# EAGLE design femto (EAGLE 6.4)
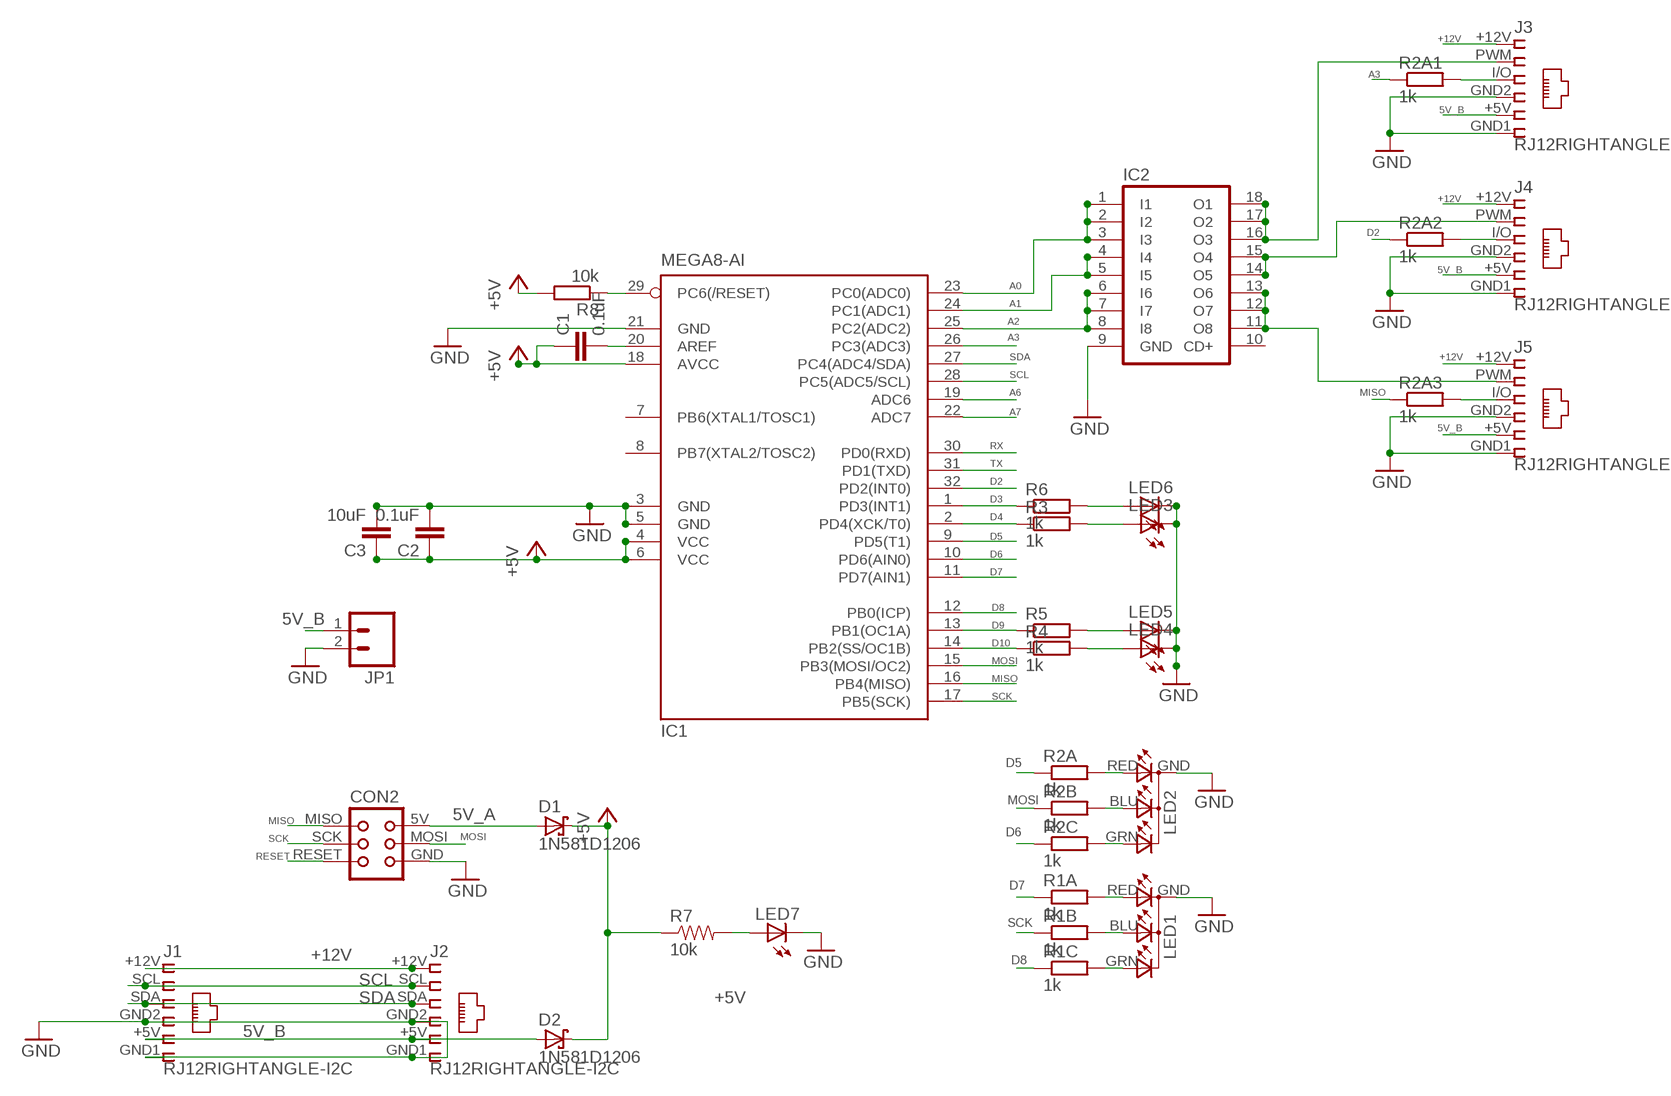
[diagram p0: schematic, sheet 1]

## Parts
C1  0.1uF  C-EUC1206  [C1206]
C2  0.1uF  C-EUC1206  [C1206]
C3  10uF  C-EUC1206  [C1206]
CON2  TINYISPTAG  [TC2030-MCP]
D1  1N581D1206  [LED-1206]
D2  1N581D1206  [LED-1206]
IC1  MEGA8-AI  [TQFP32-08]
IC2  ULN2803A  [SO18W]
J1  RJ12RIGHTANGLE-I2C  [RJ12-RIGHTANGLE-I2C]
J2  RJ12RIGHTANGLE-I2C  [RJ12-RIGHTANGLE-I2C]
J3  RJ12RIGHTANGLE  [RJ12-RIGHTANGLE]
J4  RJ12RIGHTANGLE  [RJ12-RIGHTANGLE]
J5  RJ12RIGHTANGLE  [RJ12-RIGHTANGLE]
JP1  M023.5MM  [SCREWTERMINAL-3.5MM-2]
LED1  RGB-COMMON-CATHODE  [LED-TRICOLOR-THROUGHHOLE]
LED2  RGB-COMMON-CATHODE  [LED-TRICOLOR-THROUGHHOLE]
LED3  LED3MM  [LED3MM]
LED4  LED3MM  [LED3MM]
LED5  LED3MM  [LED3MM]
LED6  LED3MM  [LED3MM]
LED7  LEDCHIP-LED0603  [CHIP-LED0603]
R1A  1k  R-EU_M1206  [M1206]
R1B  1k  R-EU_M1206  [M1206]
R1C  1k  R-EU_M1206  [M1206]
R2A  1k  R-EU_M1206  [M1206]
R2A1  1k  R-EU_M1206  [M1206]
R2A2  1k  R-EU_M1206  [M1206]
R2A3  1k  R-EU_M1206  [M1206]
R2B  1k  R-EU_M1206  [M1206]
R2C  1k  R-EU_M1206  [M1206]
R3  1k  R-EU_M1206  [M1206]
R4  1k  R-EU_M1206  [M1206]
R5  1k  R-EU_M1206  [M1206]
R6  1k  R-EU_M1206  [M1206]
R7  10k  RESISTOR0603-RES  [0603-RES]
R8  10k  R-EU_M1206  [M1206]

## Nets
5V_A: CON2.5V(VCC) D1.A
5V_B [power]: D2.A J1.+5V J2.+5V J3.+5V J4.+5V J5.+5V JP1.1
+5V [power]: C1.1 C2.1 C3.1 D1.C D2.C IC1.4(VCC) IC1.6(VCC) IC1.18(AVCC) R7.1 R8.2
+12V: J1.+12V J2.+12V J3.+12V J4.+12V J5.+12V
A0: IC1.23(PC0(ADC0)) IC2.1(I1) IC2.2(I2) IC2.3(I3)
A1: IC1.24(PC1(ADC1)) IC2.4(I4) IC2.5(I5)
A2: IC1.25(PC2(ADC2)) IC2.6(I6) IC2.7(I7) IC2.8(I8)
A3: IC1.26(PC3(ADC3)) R2A1.1
A6: IC1.19(ADC6)
A7: IC1.22(ADC7)
D2: IC1.32(PD2(INT0)) R2A2.1
D3: IC1.1(PD3(INT1)) R6.1
D4: IC1.2(PD4(XCK/T0)) R3.1
D5: IC1.9(PD5(T1)) R2A.1
D6: IC1.10(PD6(AIN0)) R2C.1
D7: IC1.11(PD7(AIN1)) R1A.1
D8: IC1.12(PB0(ICP)) R1C.1
D9: IC1.13(PB1(OC1A)) R5.1
D10: IC1.14(PB2(SS/OC1B)) R4.1
GND [power]: C2.2 C3.2 CON2.GND IC1.3(GND) IC1.5(GND) IC1.21(GND) IC2.9(GND) J1.GND1 J1.GND2 J2.GND1 J2.GND2 J3.GND1 J3.GND2 J4.GND1 J4.GND2 J5.GND1 J5.GND2 JP1.2 LED1.GND(A2) LED2.GND(A2) LED3.K(C) LED4.K(C) LED5.K(C) LED6.K(C) LED7.C
MISO: CON2.MISO IC1.16(PB4(MISO)) R2A3.1
MOSI: CON2.MOSI IC1.15(PB3(MOSI/OC2)) R2B.1
N$1: LED2.RED(CRED) R2A.2
N$2: J3.I/O R2A1.2
N$3: IC2.16(O3) IC2.17(O2) IC2.18(O1) J3.PWM
N$4: C1.2 IC1.20(AREF)
N$5: IC2.14(O5) IC2.15(O4) J4.PWM
N$6: IC2.11(O8) IC2.12(O7) IC2.13(O6) J5.PWM
N$7: LED2.BLU(CBLUE) R2B.2
N$8: LED2.GRN(CGREEN) R2C.2
N$9: J4.I/O R2A2.2
N$10: J5.I/O R2A3.2
N$15: LED7.A R7.2
N$16: LED3.A R3.2
N$20: LED1.RED(CRED) R1A.2
N$21: LED1.BLU(CBLUE) R1B.2
N$22: LED1.GRN(CGREEN) R1C.2
N$23: LED6.A R6.2
N$40: LED5.A R5.2
N$41: LED4.A R4.2
RESET: CON2.RESET IC1.29(PC6(/RESET)) R8.1
RX: IC1.30(PD0(RXD))
SCK: CON2.SCK IC1.17(PB5(SCK)) R1B.1
SCL [i2c]: IC1.28(PC5(ADC5/SCL)) J1.SCL J2.SCL
SDA [i2c]: IC1.27(PC4(ADC4/SDA)) J1.SDA J2.SDA
TX: IC1.31(PD1(TXD))
Unconnected: IC1.7(PB6(XTAL1/TOSC1)) IC1.8(PB7(XTAL2/TOSC2)) IC2.10(CD+)

## Library data of the parts
C1-C3 = resistor:C-EU: CAPACITOR, European symbol
CON2 = lpatiny:TINYISP: CONNECTOR
D1 D2 = lpatiny:1N581*: 1.0A SCHOTTKY BARRIER RECTIFIER Source: http://www.diodes.com/datasheets/ds23001.pdf
IC1 = atmel:MEGA8: MICROCONTROLLER 8 Kbytes FLASH, 1 kbytes SRAM, 512 bytes EEPROM, USART, 6-channel 10 bit ADC, 2-channel 8 bit ADC Pin compatible with Atmega48, ATMega88, ATMega168 Source: avr.lbr; MPN: ATMEGA8-16AU; OC_FARNELL: 9171371; OC_NEWARK: 73M8863
IC2 = lpatiny:ULN2803A: DRIVER ARRAY
J1-J5 = lpatiny:RJ12: CORCOM Modular RJ Jacks No Shield Source: www.tycoelectronics.com .. ENG_DS_1654001_1099_RJ_L_0507.pdf
JP1 = SparkFun:M02: Header 2 Standard 2-pin 0.1" header. Use with straight break away headers (SKU : PRT-00116), right angle break away headers (PRT-00553), swiss pins (PRT-00743), machine pins (PRT-00117), and female headers (PRT-00115). Molex polarized connector foot print use with SKU : PRT-08233 with associated crimp pins and housings.
LED1 LED2 = lpatiny:RGB-COMMON-CATHODE
LED3-LED6 = lpatiny:LED3MM
LED7 = adafruit:LED: LED OSRAM: - CHIPLED LG R971, LG N971, LY N971, LG Q971, LY Q971, LO R971, LY R971 LH N974, LH R974 LS Q976, LO Q976, LY Q976 LO Q996 - Hyper CHIPLED LW Q18S LB Q993, LB Q99A, LB R99A - SideLED LS A670, LO A670, LY A670, LG A670, LP A670 LB A673, LV A673, LT A673, LW A673 LH A674 LY A675 LS A676, LA A676, LO A676, LY A676, LW A676 LS A679, LY A679, LG A679 - Hyper Micro SIDELED® LS Y876, LA Y876, LO Y876, LY Y876 LT Y87S - SmartLED LW L88C, LW L88S LB L89C, LB L89S, LG L890 LS L89K, LO L89K, LY L89K LS L896, LA L896, LO L896, LY L896 - TOPLED LS T670, LO T670, LY T670, LG T670, LP T670 LSG T670, LSP T670, LSY T670, LOP T670, LYG T670 LG T671, LOG T671, LSG T671 LB T673, LV T673, LT T673, LW T673 LH T674 LS T676, LA T676, LO T676, LY T676, LB T676, LH T676, LSB T676, LW T676 LB T67C, LV T67C, LT T67C, LS T67K, LO T67K, LY T67K, LW E67C LS E67B, LA E67B, LO E67B, LY E67B, LB E67C, LV E67C, LT E67C LW T67C LS T679, LY T679, LG T679 LS T770, LO T770, LY T770, LG T770, LP T770 LB T773, LV T773, LT T773, LW T773 LH T774 LS E675, LA E675, LY E675, LS T675 LS T776, LA T776, LO T776, LY T776, LB T776 LHGB T686 LT T68C, LB T68C - Hyper Mini TOPLED® LB M676 - Mini TOPLED Santana® LG M470 LS M47K, LO M47K, LY M47K Source: http://www.osram.convergy.de/
R1A R1B R1C R2A R2A1-R2A3 R2B R2C R3-R6 R8 = resistor:R-EU_: RESISTOR, European symbol
R7 = SparkFun:RESISTOR: Resistor Basic schematic elements and footprints for 0603, 1206, and PTH resistors.

## Net classes
0 default: width 0.305 mm
1 power: width 0.457 mm
2 i2c: width 0.305 mm
3 fine: width 0.305 mm

## Board
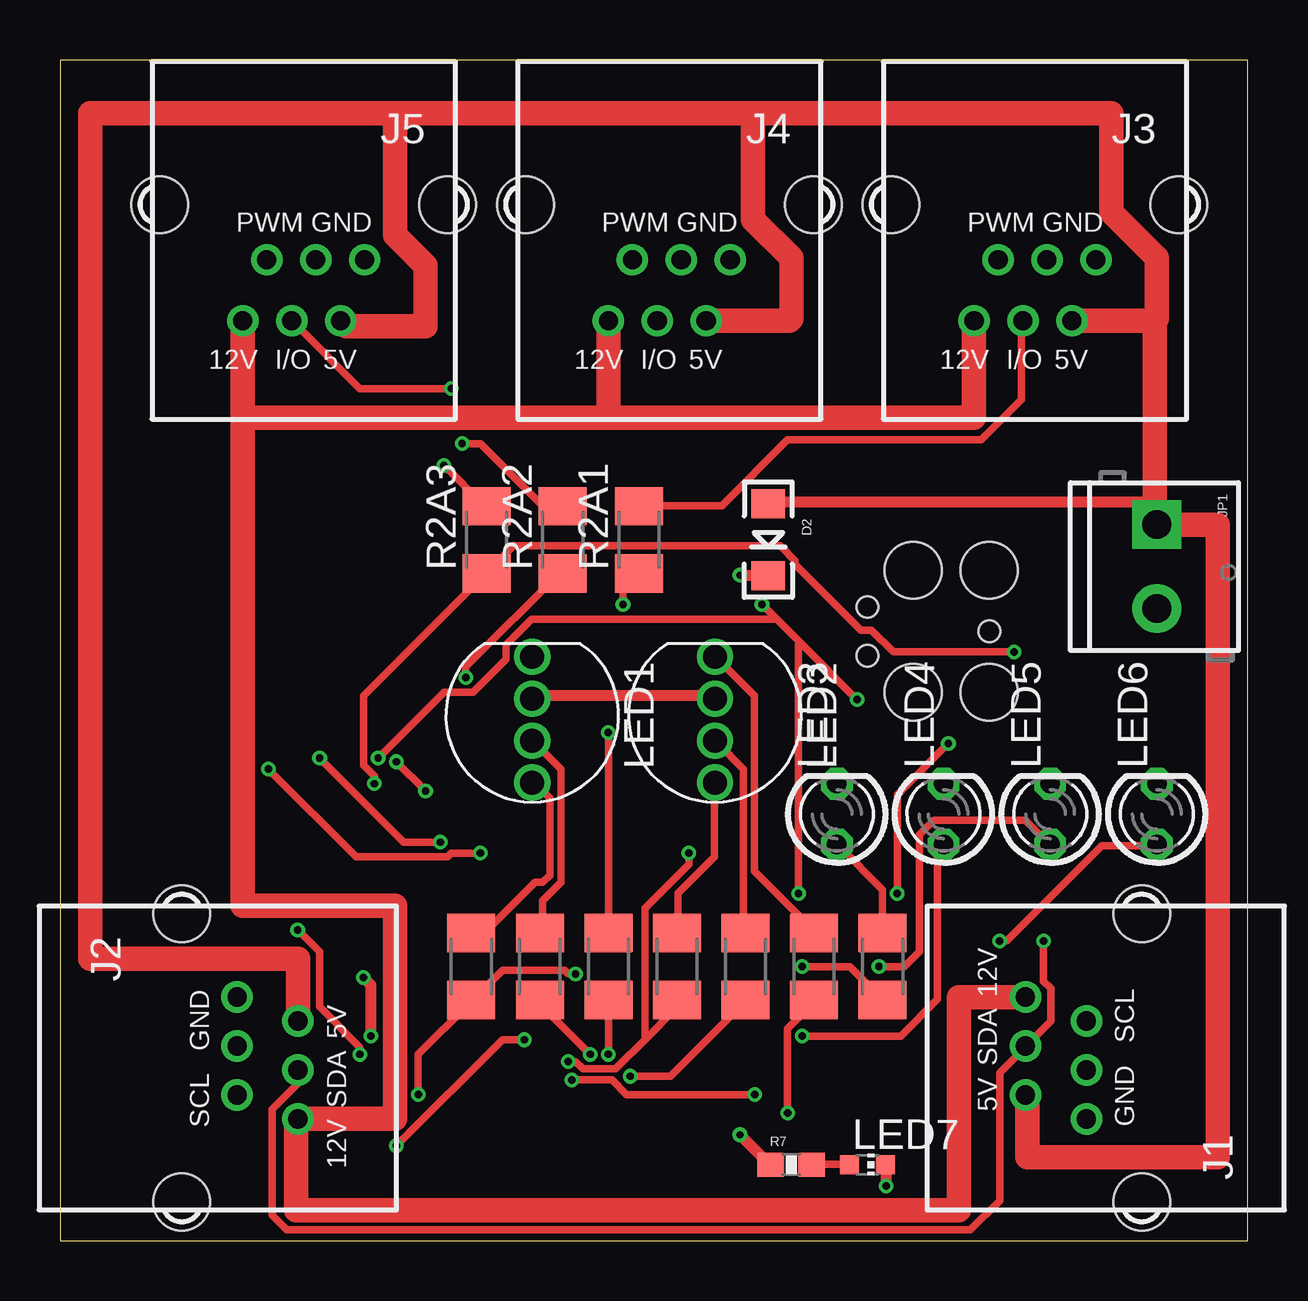
[diagram p1: board, top side]
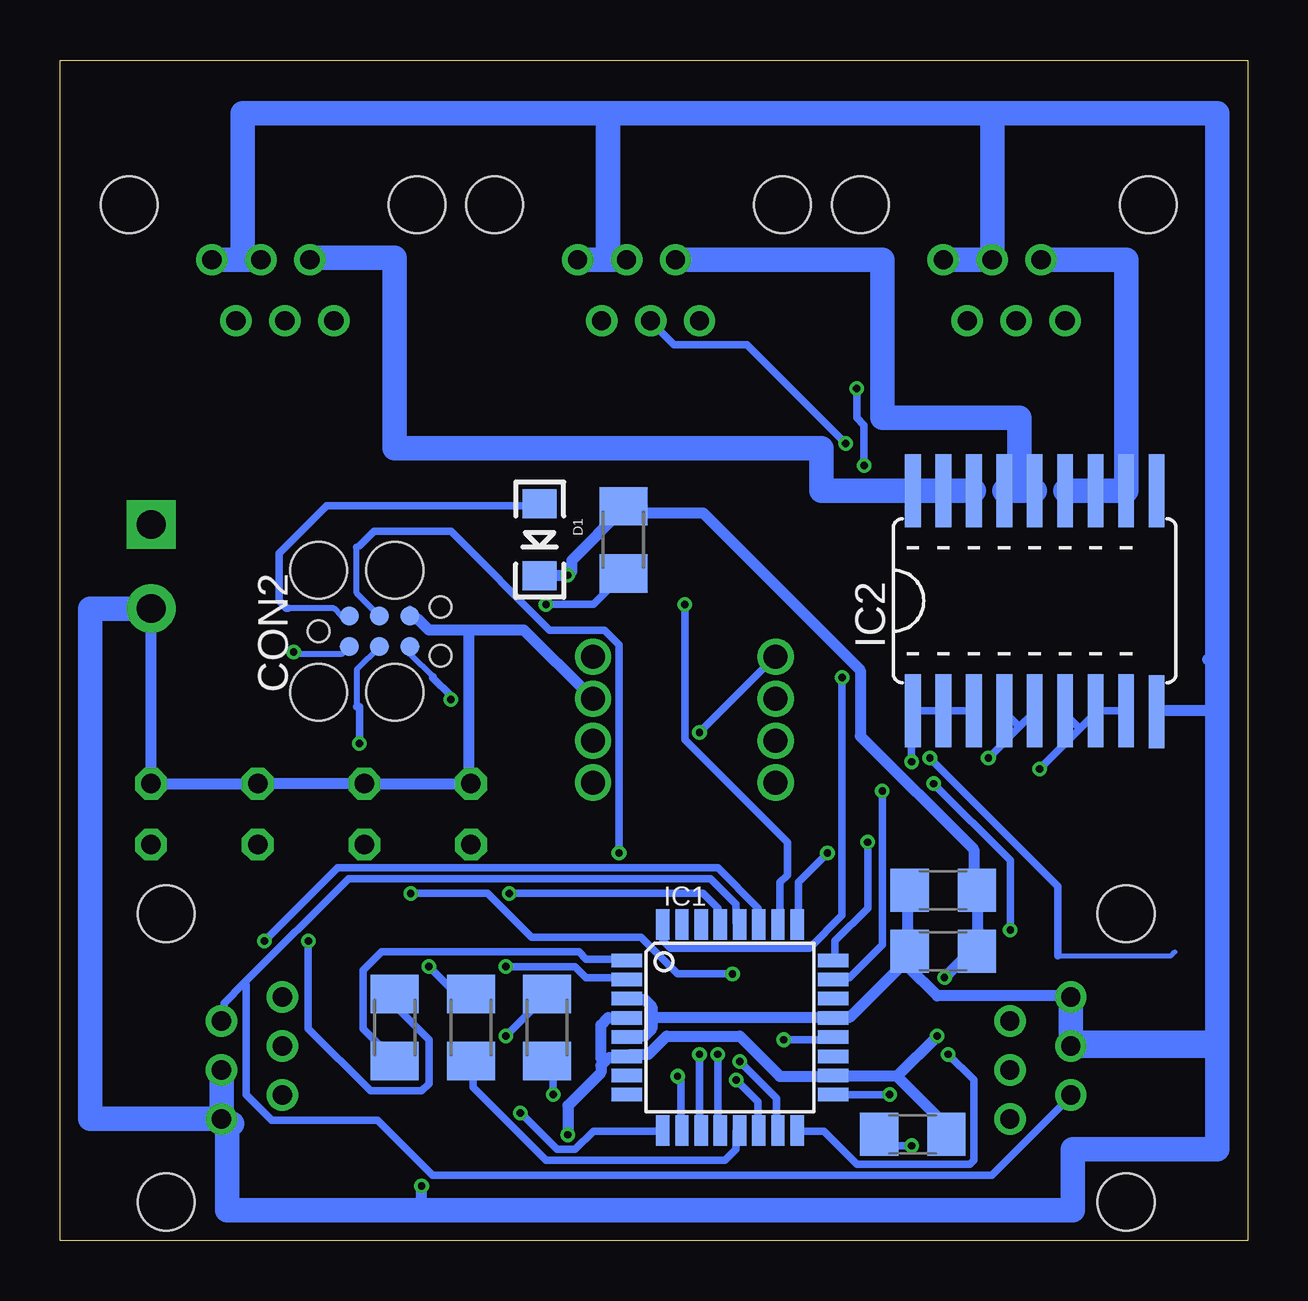
[diagram p2: board, bottom side, seen from below]

Size 49.52 x 49.2 mm. Coordinates in mm from the lower left corner, seen from the top.
Outline: 0,0 49.52,0 49.52,49.2 0,49.2 0,0
Copper layers (1*16): Top 0.035mm / dielectric 1.5mm / Bottom 0.035mm
Design rules "default": minimum track width 6mil, minimum drill 12mil, track to track 6mil, track to pad 6mil, pad to pad 6mil, via to via 6mil, smd to smd 0mil, copper to edge 10mil, drill to drill 10mil, minimum pad ring 10mil, minimum via ring 6mil, stop-mask expansion 2mil, vias tented up to drill 100mil, thermal gap 10mil
vRestrict: area 15.2,2.5 to 19.1,15.2; area 24.1,2.5 to 27.9,15.2; area 15.2,2.5 to 27.9,6.4; area 15.2,11.4 to 27.9,15.2; area 33,22.9 to 39.4,27.9

### Footprints (pad centres in the part's own frame; a part is rotated, then mirrored left to right if it is on the bottom)
C1206 = smd 1.6 x 1.8: 1 -1.4,0; 2 1.4,0
TC2030-MCP = smd 0.787 x 0.787: 5V 1.27,0.635; GND 3.81,0.635; MISO 1.27,-0.635; MOSI 2.54,0.635; RESET 3.81,-0.635; SCK 2.54,-0.635 | hole 0.889: 0,0; 5.08,-1.016; 5.08,1.016 | hole 2.375: 0,2.54; 0,-2.54; 3.175,-2.54; 3.175,2.54
LED-1206 = smd 1.2 x 1.4: A -1.5,0; C 1.5,0
TQFP32-08 = smd 1.27 x 0.559: 1 -4.293,2.8; 2 -4.293,2; 3 -4.293,1.2; 4 -4.293,0.4; 5 -4.293,-0.4; 6 -4.293,-1.2; 7 -4.293,-2; 8 -4.293,-2.8; 17 4.293,-2.8; 18 4.293,-2; 19 4.293,-1.2; 20 4.293,-0.4; 21 4.293,0.4; 22 4.293,1.2; 23 4.293,2; 24 4.293,2.8 | smd 0.559 x 1.27: 9 -2.8,-4.293; 10 -2,-4.293; 11 -1.2,-4.293; 12 -0.4,-4.293; 13 0.4,-4.293; 14 1.2,-4.293; 15 2,-4.293; 16 2.8,-4.293; 25 2.8,4.293; 26 2,4.293; 27 1.2,4.293; 28 0.4,4.293; 29 -0.4,4.293; 30 -1.2,4.293; 31 -2,4.293; 32 -2.8,4.293
SO18W = smd 0.66 x 3.048: 1 -5.08,-4.585; 2 -3.81,-4.585; 3 -2.54,-4.585; 4 -1.27,-4.585; 5 0,-4.585; 6 1.27,-4.585; 7 2.54,-4.585; 8 3.81,-4.585; 9 5.08,-4.623; 10 5.08,4.585; 11 3.81,4.585; 12 2.54,4.585; 13 1.27,4.585; 14 0,4.585; 15 -1.27,4.585; 16 -2.54,4.585; 17 -3.81,4.585; 18 -5.08,4.585
RJ12-RIGHTANGLE-I2C = drill 0.8 pad 1.3: +5V -1.54,4.84; +12V 2.54,4.84; GND1 -2.54,2.3; GND2 -0.5,2.3; SCL 1.54,2.3; SDA 0.5,4.84 | hole 2.36: -6,0; 6,0
RJ12-RIGHTANGLE = drill 0.8 pad 1.3: +5V -1.54,4.84; +12V 2.54,4.84; GND1 -2.54,2.3; GND2 -0.5,2.3; I/O 0.5,4.84; PWM 1.54,2.3 | hole 2.36: -6,0; 6,0
SCREWTERMINAL-3.5MM-2 = drill 1.2 pad 2.032 square: 1 0,0 | drill 1.2 pad 2.032: 2 3.5,0
LED-TRICOLOR-THROUGHHOLE = drill 1: BLU 2.492,0; GND -1,0; GRN 0.746,0; RED -2.746,0
LED3MM = drill 0.813 octagon: A -1.27,0; K 1.27,0
CHIP-LED0603 = smd 0.8 x 0.8: A 0,-0.75; C 0,0.75
M1206 = smd 1.6 x 2: 1 -1.4,0; 2 1.4,0
0603-RES = smd 1.1 x 1: 1 -0.85,0; 2 0.85,0

### Placement (x,y rotation side)
C1  13.97,4.45 180 bottom
C2  12.7,12.06 180 bottom
C3  12.7,14.61 180 bottom
CON2  38.73,25.4 0 bottom
D1  29.53,29.21 270 bottom
D2  29.53,29.21 270 top
IC1  21.59,8.89 0 bottom
IC2  8.89,26.67 0 bottom
J1  45.09,7.62 90 top
J2  5.08,7.62 270 top
J3  40.64,43.18 180 top
J4  25.4,43.18 180 top
J5  10.16,43.18 180 top
JP1  45.72,29.84 270 top
LED1  19.68,21.59 270 top
LED2  27.3,21.59 270 top
LED3  32.38,17.78 90 top
LED4  36.83,17.78 90 top
LED5  41.27,17.78 90 top
LED6  45.72,17.78 90 top
LED7  33.66,3.17 270 top
R1A  22.86,11.43 90 top
R1B  17.14,11.43 90 top
R1C  20,11.43 90 top
R2A  31.43,11.43 90 top
R2A1  24.13,29.21 90 top
R2A2  20.95,29.21 90 top
R2A3  17.78,29.21 90 top
R2B  25.72,11.43 90 top
R2C  28.57,11.43 90 top
R3  34.29,11.43 90 top
R4  29.21,8.89 90 bottom
R5  32.38,8.89 90 bottom
R6  35.56,8.89 90 bottom
R7  30.48,3.17 0 top
R8  26.04,29.21 90 bottom

### Tracks (layer width: path | path; a pad name or v marks a point on that pad's centre or on a via)
5V_A
  Bottom 0.254: CON2.5V 37.78,26.04 38.1,26.35 40.01,26.35
  Bottom 0.305: D1.A 29.57,30.63 38.41,30.63 40.39,28.65 40.39,26.67 40.08,26.36 40.01,26.35
5V_B
  Top 0.457: D2.A 29.57,30.79 45.26,30.79 JP1.1
  Top 1.016: J1.+5V 40.32,6.08 40.32,3.49 48.26,3.49 48.26,29.84 JP1.1 45.64,29.84 45.64,38.34 | 1.27,12.06 1.27,11.75 1.59,11.75 | J2.+5V 9.92,11.75 1.59,11.75 | 1.59,11.75 1.27,12.06 | 1.27,12.06 1.27,46.99 13.97,46.99 | 13.97,46.99 13.97,41.91 15.24,40.64 15.24,38.1 11.94,38.1 J5.+5V | J4.+5V 30.4,38.34 30.48,38.42 30.48,40.96 28.89,42.55 28.89,46.99 | 28.89,46.99 13.97,46.99 | J3.+5V 45.64,38.34 | 45.64,38.34 45.72,38.42 45.72,40.96 43.81,42.86 43.81,46.99 28.89,46.99
+5V  (via drill 0.3)
  Top 0.457: v28.35,4.42 29.57,3.2 R7.1 | v28.35,27.74 29.41,27.74 D2.C | v12.95,8.53 12.95,10.67 v12.65,10.97
  Bottom 0.457: 14.63,6.86 17.22,6.86 IC1.18 17.53,6.86 19.51,6.86 21.18,8.53 24.23,8.53 24.99,7.77 25.76,7.77 IC1.6 25.91,7.62 26.67,7.62 26.82,7.47 | 14.63,6.86 12.65,4.88 12.65,4.57 C1.1 | v28.35,4.42 28.35,5.64 26.98,7.01 26.98,7.32 26.82,7.47 | IC1.4 25.91,9.3 26.67,9.3 26.98,8.99 26.98,7.62 26.82,7.47 | D2.C 29.41,27.74 v28.35,27.74 28.19,27.89 28.19,28.35 26.06,30.48 R8.2 25.91,30.33 22.71,30.33 16.15,23.77 16.15,21.03 11.43,16.31 11.43,14.78 C3.1 11.28,14.48 11.28,12.19 C2.1 11.43,12.19 v12.65,10.97 | v12.95,8.53 14.63,6.86
+12V
  Top 1.016: J1.+12V 37.47,10.16 37.47,1.27 9.84,1.27 9.84,5.08 J2.+12V 13.97,5.08 13.97,13.97 7.62,13.97 7.62,34.29 | J5.+12V 7.62,34.29 | 7.62,34.29 22.86,34.29 | J4.+12V 22.86,34.29 | 22.86,34.29 38.1,34.29 J3.+12V
A0  (via drill 0.3)
  Top 0.305: v14.02,19.96 v15.24,18.75
  Bottom 0.305: IC2.3 12.65,22.1 IC2.2 12.8,22.1 13.87,22.1 IC2.1 14.02,21.95 v14.02,19.96 | v15.24,18.75 15.24,12.34 16.61,10.97 17.22,10.97 IC1.23
A1  (via drill 0.3)
  Top 0.305: v15.85,16.61 14.33,16.61 v10.82,20.12
  Bottom 0.305: v15.85,16.61 15.85,13.87 17.22,12.5 17.22,11.73 IC1.24 | 9.53,21.41 8.99,21.95 IC2.5 | 9.53,21.41 v10.82,20.12 | 9.53,21.41 10.06,21.95 IC2.4
A2  (via drill 0.3)
  Top 0.305: v17.53,16.15 16.31,16.15 16.15,16 12.34,16 v8.69,19.66
  Bottom 0.305: v17.53,16.15 18.75,14.94 18.75,13.26 IC1.25 | 7.01,21.34 6.4,21.95 IC2.7 6.25,22.1 5.18,22.1 IC2.8 | 7.01,21.34 v8.69,19.66 | 7.01,21.34 7.62,21.95 IC2.6
A3  (via drill 0.3)
  Top 0.305: v23.47,26.52 23.47,27.13 24.08,27.74 R2A1.1
  Bottom 0.305: v23.47,26.52 23.47,20.88 19.2,16.61 19.2,15.24 19.51,14.94 19.51,13.26 IC1.26
D2  (via drill 0.3)
  Top 0.305: v16.92,23.47 16.92,23.93 20.88,27.89 R2A2.1
  Bottom 0.305: v16.92,23.47 16.92,13.56 18.29,12.19 24.08,12.19 24.38,12.5 24.38,13.11 IC1.32
D3
  Bottom 0.305: IC1.1 25.91,11.73 27.58,11.73 27.89,12.04 36.12,12.04 36.88,11.28 36.88,8.84 35.66,7.62 R6.1
D4  (via drill 0.3)
  Top 0.305: v30.94,11.43 32.92,11.43 34.29,10.06 R3.1
  Bottom 0.305: v30.94,11.43 28.04,11.43 27.58,10.97 25.91,10.97 IC1.2
D5  (via drill 0.3)
  Top 0.305: v30.33,5.33 30.33,8.84 31.39,9.91 R2A.1
  Bottom 0.305: v30.33,5.33 28.8,3.81 28.04,3.81 27.28,4.57 24.54,4.57 IC1.9
D6  (via drill 0.3)
  Top 0.305: v23.77,6.86 25.45,6.86 28.5,9.91 R2C.1
  Bottom 0.305: v23.77,6.86 23.62,6.71 23.62,4.72 IC1.10
D7  (via drill 0.3)
  Top 0.305: R1A.1 v22.86,7.77
  Bottom 0.305: v22.86,7.77 22.86,4.72 IC1.11
D8  (via drill 0.3)
  Top 0.305: v22.1,7.77 19.96,9.91 R1C.1
  Bottom 0.305: v22.1,7.77 22.1,4.72 IC1.12
D9
  Bottom 0.305: IC1.13 21.34,4.57 21.34,3.81 21.79,3.35 29.26,3.35 32.31,6.4 32.31,7.47 R5.1
D10  (via drill 0.3)
  Top 0.305: v21.34,6.71 23.01,6.71 23.62,6.1 v28.96,6.1
  Bottom 0.305: v21.34,6.71 20.42,5.79 20.42,4.72 IC1.14 | v28.96,6.1 28.96,7.32 29.11,7.47 R4.1
GND  (via drill 0.3)
  Top 0.457: LED1.GND 19.81,22.71 27.28,22.71 LED2.GND | v34.44,2.29 34.44,3.05 LED7.C
  Bottom 0.254: CON2.GND 34.92,26.35
  Bottom 0.457: 42.34,4.88 J1.GND1 | 41.3,19.05 LED5.K | 1.68,24.23 1.27,24.13 | 32.46,25.45 30.18,25.45 27.43,22.71 LED2.GND | 32.46,25.45 34.14,25.45 34.59,25.91 34.9,25.91 CON2.GND | 25.91,8.53 IC1.5 25.76,8.53 25.15,8.53 24.84,8.84 24.84,9.3 | 24.84,9.3 24.84,9.75 25.15,10.06 25.76,10.06 IC1.3 | 17.37,9.3 IC1.21 | IC1.21 17.07,9.3 16.61,9.3 14.17,11.73 14.17,12.04 C2.2 | C3.2 14.17,14.48 14.17,12.19 C2.2 | 24.84,9.3 17.53,9.3 IC1.21 | LED5.K LED4.K LED3.K 32.46,19.2 32.46,25.45 | 3.81,22.1 IC2.9 3.66,22.1 1.27,22.1 | 34.44,1.27 v34.44,2.29 | JP1.2 LED6.K LED5.K | C2.2 14.17,11.43 12.95,10.21 7.77,10.21 J2.GND1
  Bottom 1.016: 1.27,8.12 1.27,8.26 | 1.27,8.26 1.27,22.1 1.27,24.13 1.27,46.99 10.66,46.99 | J1.GND2 J1.GND1 48.26,5.08 48.26,26.34 JP1.2 | 1.27,8.12 J2.GND2 J2.GND1 7.38,8.26 1.27,8.26 | 10.66,46.99 J5.GND2 J5.GND1 | 26.67,40.88 26.67,46.99 | 26.67,46.99 10.66,46.99 | J4.GND2 26.67,40.88 | 26.67,40.88 J4.GND1 | J3.GND1 J3.GND2 41.91,40.88 41.91,46.99 26.67,46.99 | 1.27,8.12 1.27,3.81 7.3,3.81 7.3,1.27 34.44,1.27 42.55,1.27 42.55,4.88 42.34,4.88
MISO  (via drill 0.3)
  Top 0.305: v12.5,7.77 12.5,8.08 10.82,9.75 10.82,12.04 v9.91,12.95 | v13.11,19.05 13.11,19.36 12.65,19.81 12.65,22.71 17.68,27.74 R2A3.1 17.83,27.89 18.9,28.96 30.02,28.96 30.63,28.35 30.63,28.19 33.38,25.45 33.83,25.45 34.75,24.54 v39.78,24.54
  Bottom 0.254: CON2.MISO 37.78,24.45 39.69,24.45
  Bottom 0.305: v12.5,7.77 11.43,6.71 11.43,3.35 11.58,3.2 16.31,3.2 17.68,4.57 18.75,4.57 IC1.16 | v9.91,12.95 9.91,15.85 v13.11,19.05 | v39.78,24.54 39.69,24.45
MOSI  (via drill 0.3)
  Top 0.305: v21.18,7.47 21.49,7.47 21.79,7.16 23.16,7.16 24.46,8.46 | 24.46,8.46 25.6,9.6 25.6,9.91 R2B.1 | v26.21,16.15 26.21,15.7 24.38,13.87 24.38,8.53 24.46,8.46
  Bottom 0.254: CON2.MOSI 37.15,26.99 37.15,28.89
  Bottom 0.305: v21.18,7.47 19.66,5.94 19.66,4.72 IC1.15 | v26.21,16.15 26.21,24.84 26.82,25.45 29.11,25.45 33.22,29.57 36.42,29.57 37.03,28.96 37.15,28.89
N$1
  Top 0.305: R2A.2 31.39,12.95 28.96,15.39 28.96,22.71 27.43,24.23 LED2.RED
N$2
  Top 0.305: R2A1.2 24.23,30.63 27.58,30.63 30.33,33.38 38.41,33.38 40.08,35.05 40.08,38.25 J3.I/O
N$3
  Bottom 1.016: IC2.17 IC2.16 17.78,31.25 17.78,33.02 35.56,33.02 35.56,40.96 39.1,40.96 J3.PWM | IC2.17 | IC2.17 IC2.18
N$4  (via drill 0.3)
  Top 0.305: v19.36,8.38 18.44,8.38 v14.02,3.96
  Bottom 0.305: v19.36,8.38 17.37,8.38 IC1.20 | v14.02,3.96 14.78,3.96 15.24,4.42 C1.2
N$5
  Bottom 1.016: IC2.15 IC2.14 9.53,31.25 9.53,34.29 15.24,34.29 15.24,40.88 J4.PWM | IC2.15
N$6
  Bottom 1.016: IC2.11 | IC2.11 IC2.12 | IC2.12 | IC2.12 IC2.13 | IC2.11 5.08,40.88 J5.PWM
N$7
  Top 0.305: R2B.2 25.76,12.95 25.76,14.48 27.28,16 27.28,19.05 LED2.BLU
N$8
  Top 0.305: R2C.2 28.5,12.95 28.5,19.66 27.43,20.73 LED2.GRN
N$9  (via drill 0.3)
  Top 0.305: v16.76,33.22 17.53,33.22 20.12,30.63 20.88,30.63 R2A2.2
  Bottom 0.305: v16.76,33.22 20.88,37.34 23.93,37.34 24.84,38.25 J4.I/O
N$10  (via drill 0.3)
  Top 0.305: v16,32.31 17.68,30.63 R2A3.2 | v16.31,35.51 12.5,35.51 9.75,38.25 J5.I/O
  Bottom 0.305: v16,32.31 16,33.98 16.31,34.29 v16.31,35.51
N$15
  Top 0.305: LED7.A 32.77,3.2 31.39,3.2 R7.2
N$16
  Top 0.305: R3.2 34.29,14.63 32.46,16.46 LED3.A
N$20  (via drill 0.3)
  Top 0.305: v22.86,21.18 R1A.2
  Bottom 0.305: v22.86,21.18 19.81,24.23 LED1.RED
N$21
  Top 0.305: R1B.2 17.22,12.95 17.83,12.95 19.81,14.94 20.12,14.94 20.42,15.24 20.42,18.44 19.81,19.05 LED1.BLU
N$22
  Top 0.305: R1C.2 20.12,12.95 20.12,14.17 20.88,14.94 20.88,19.66 19.81,20.73 LED1.GRN
N$23  (via drill 0.3)
  Top 0.305: v39.17,12.5 39.47,12.5 43.43,16.46 45.72,16.46 LED6.A
  Bottom 0.305: v39.17,12.5 39.17,8.84 36.58,6.25 34.44,6.25 34.14,6.55 34.14,8.38 35.51,9.75 35.51,10.21 R6.2
N$40  (via drill 0.3)
  Top 0.203: 41.15,16.46 LED5.A
  Top 0.305: v34.14,11.43 35.2,11.43 35.81,12.04 35.81,16.92 36.42,17.53 40.23,17.53 41.15,16.61 LED5.A
  Bottom 0.305: v34.14,11.43 33.07,10.36 32.46,10.36 R5.2
N$41  (via drill 0.3)
  Top 0.305: v30.94,8.53 35.05,8.53 36.58,10.06 36.58,16.31 36.73,16.46 LED4.A
  Bottom 0.305: v30.94,8.53 29.26,10.21 R4.2
RESET  (via drill 0.3)
  Top 0.305: v29.26,26.52 29.79,25.98 | 29.79,25.98 30.86,24.92 | 30.86,24.92 v33.22,22.55 | v30.79,14.48 30.79,24.84 30.86,24.92 | v13.26,20.12 16,22.86 17.22,22.86 18.59,24.23 18.59,24.84 19.66,25.91 29.72,25.91 29.79,25.98
  Bottom 0.203: 3.05,12.04 3.2,11.89 7.92,11.89
  Bottom 0.254: CON2.RESET 34.92,24.45 33.97,23.5
  Bottom 0.305: v33.22,22.55 33.22,22.71 33.98,23.47 33.97,23.5 | v29.26,26.52 27.28,26.52 26.06,27.74 R8.1 | v30.79,14.48 22.71,14.48 22.1,13.87 22.1,13.26 IC1.29 | 7.92,11.89 7.92,14.78 v13.26,20.12
SCK  (via drill 0.3)
  Top 0.305: v14.94,6.1 14.94,7.77 17.07,9.91 R1B.1 17.22,10.06 18.44,11.28 21.03,11.28 21.18,11.12 v21.49,11.12 | v37.03,20.73 34.9,18.59 v34.9,14.48
  Bottom 0.254: CON2.SCK 37.15,23.81 37.15,22.25 37.15,22.23
  Bottom 0.305: v14.94,6.1 17.22,6.1 IC1.17 | v37.03,20.73 37.03,22.25 37.15,22.25 | v34.9,14.48 31.7,14.48 29.87,12.65 25.3,12.65 23.77,11.12 v21.49,11.12
SCL
  Bottom 0.305: 41.83,10.74 42.67,9.91 42.67,9.3 J1.SCL | 41.83,10.74 37.49,15.09 22.4,15.09 21.34,14.02 21.34,13.26 IC1.28 | J2.SCL 7.47,5.94 10.67,2.74 33.98,2.74 36.27,5.03 40.69,5.03 41.76,6.1 41.76,10.67 41.83,10.74
SDA  (via drill 0.3)
  Top 0.305: v41,12.5 41,10.82 41.3,10.52 41.3,9.14 40.39,8.23 J1.SDA 40.23,8.08 39.17,7.01 39.17,1.68 37.95,0.46 9.45,0.46 8.84,1.07 8.84,5.49 9.91,6.55 9.91,7.01 J2.SDA
  Bottom 0.305: v41,12.5 37.95,15.54 22.1,15.54 20.42,13.87 20.42,13.26 IC1.27